# EAGLE design uStatusBoard (EAGLE 8.6.0)
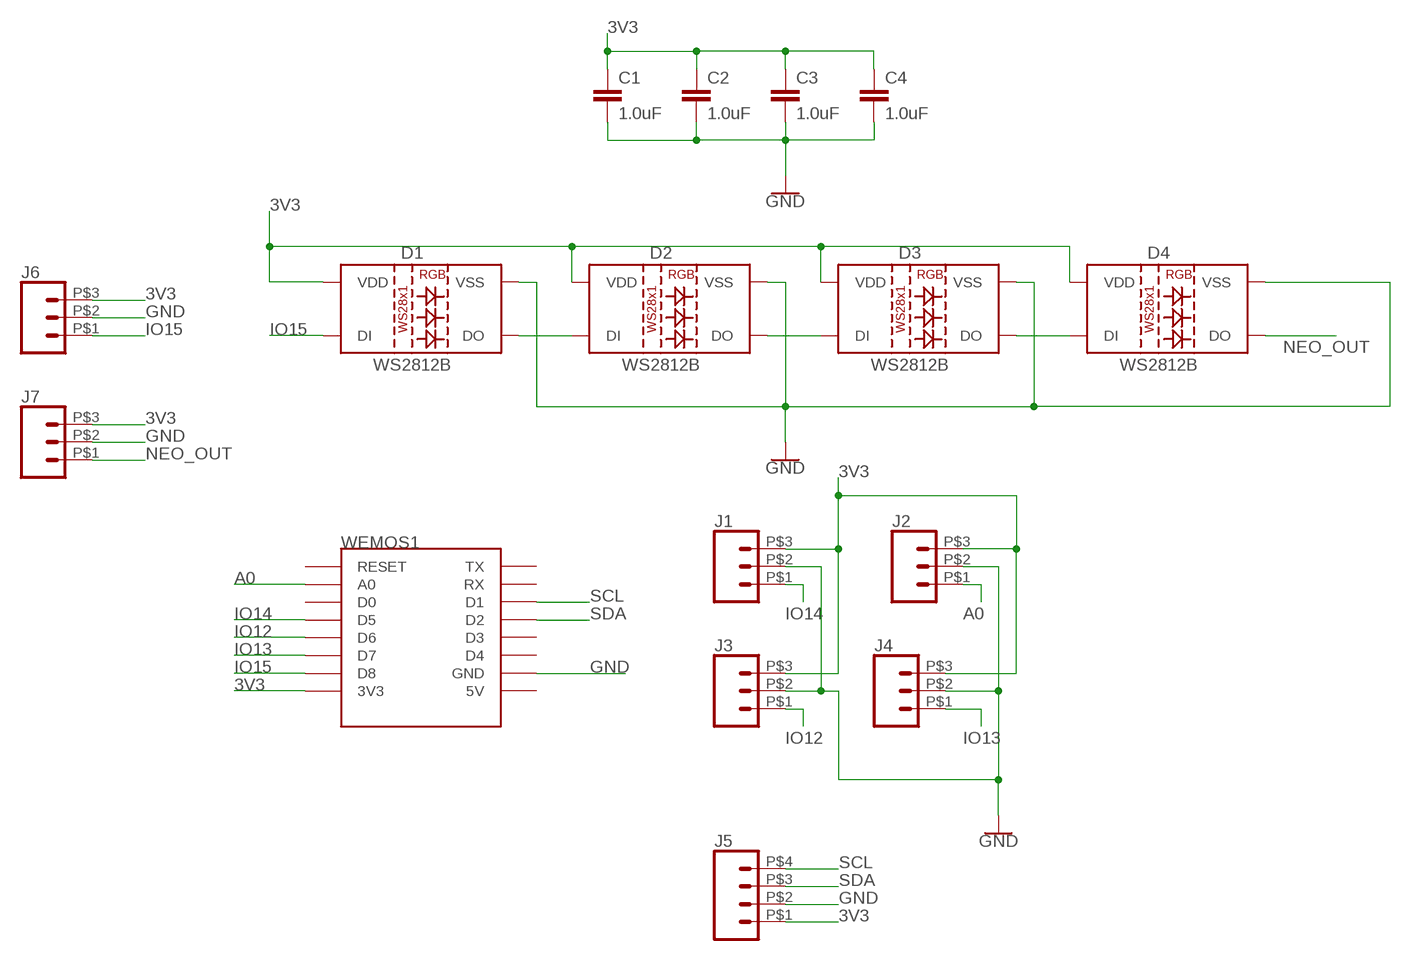
[diagram p0: schematic, sheet 1]

## Parts
C1  1.0uF  1.0UF-0805-25V-10%  [0805]
C2  1.0uF  1.0UF-0805-25V-10%  [0805]
C3  1.0uF  1.0UF-0805-25V-10%  [0805]
C4  1.0uF  1.0UF-0805-25V-10%  [0805]
D1  WS2812B  [WS2812B]
D2  WS2812B  [WS2812B]
D3  WS2812B  [WS2812B]
D4  WS2812B  [WS2812B]
J1  CONN_031X03_SMD  [1X03_SMD]
J2  CONN_031X03_SMD  [1X03_SMD]
J3  CONN_031X03_SMD  [1X03_SMD]
J4  CONN_031X03_SMD  [1X03_SMD]
J5  CONN_041X04_SMD  [1X04_SMD]
J6  CONN_031X03_SMD  [1X03_SMD]
J7  CONN_031X03_SMD  [1X03_SMD]
WEMOS1  WEMOS-D1-MINIWEMOS_SMD  [WEMOS-SMD]

## Nets
3V3: C1.1 C2.1 C3.1 C4.1 D1.1(VDD) D2.1(VDD) D3.1(VDD) D4.1(VDD) J1.P$3 J2.P$3 J3.P$3 J4.P$3 J5.P$1 J6.P$3 J7.P$3 WEMOS1.3V3
A0: J2.P$1 WEMOS1.A0
GND: C1.2 C2.2 C3.2 C4.2 D1.3(VSS) D2.3(VSS) D3.3(VSS) D4.3(VSS) J1.P$2 J2.P$2 J3.P$2 J4.P$2 J5.P$2 J6.P$2 J7.P$2 WEMOS1.GND
IO12: J3.P$1 WEMOS1.D6
IO13: J4.P$1 WEMOS1.D7
IO14: J1.P$1 WEMOS1.D5
IO15: D1.4(DI) J6.P$1 WEMOS1.D8
N$3: D1.2(DO) D2.4(DI)
N$4: D2.2(DO) D3.4(DI)
N$5: D3.2(DO) D4.4(DI)
NEO_OUT: D4.2(DO) J7.P$1
SCL: J5.P$4 WEMOS1.D1
SDA: J5.P$3 WEMOS1.D2
Unconnected: WEMOS1.5V WEMOS1.D0 WEMOS1.D3 WEMOS1.D4 WEMOS1.RESET WEMOS1.RX WEMOS1.TX

## Library data of the parts
C1-C4 = SparkFun-Capacitors:1.0UF: 1µF ceramic capacitors A capacitor is a passive two-terminal electrical component used to store electrical energy temporarily in an electric field.; PROD_ID: CAP-08064
D1-D4 = SparkFun-LED:WS2812B: WS2812B SMD addressable RGB LED 5x5mm SMD LED with built-in controller IC. Color: Red/Green/Blue mC Rating: RGB: 390, 660, 180 mcd Forward Voltage: RGB: 2.0, 3.0, 3.0 V Packages:WS2812B SparkFun Products: Blynk Board - ESP8266 <https://www.sparkfun.com/products/13794>; PROD_ID: DIO-12503
J1-J4 J6 J7 = SparkFun-Connectors:CONN_03: Multi connection point. Often used as Generic Header-pin footprint for 0.1 inch spaced/style header connections On any of the 0.1 inch spaced packages, you can populate with these: Break Away Headers - Straight <https://www.sparkfun.com/products/116> (PRT-00116) Break Away Male Headers - Right Angle <https://www.sparkfun.com/products/553> (PRT-00553) Female Headers <https://www.sparkfun.com/products/115> (PRT-00115) Break Away Headers - Machine Pin <https://www.sparkfun.com/products/117> (PRT-00117) Break Away Female Headers - Swiss Machine Pin <https://www.sparkfun.com/products/743> (PRT-00743) Stackable Header - 3 Pin (Female, 0.1") <https://www.sparkfun.com/products/13875> (PRT-13875) For SCREWTERMINALS and SPRING TERMINALS visit here: Screw Terimnals on SparkFun.com <https://www.sparkfun.com/search/results?term=Screw+Terminals> (5mm/3.5mm/2.54mm spacing) This device is also useful as a general connection point to wire up your design to another part of your project. Our various solder wires solder well into these plated through hole pads. Hook-Up Wire - Assortment (Stranded, 22 AWG) <https://www.sparkfun.com/products/11375> (PRT-11375) Hook-Up Wire - Assortment (Solid Core, 22 AWG) <https://www.sparkfun.com/products/11367> (PRT-11367) View the entire wire category on our website here <https://www.sparkfun.com/categories/141> Special notes: Molex polarized connector foot print use with SKU : PRT-08232 with associated crimp pins and housings.
J5 = SparkFun-Connectors:CONN_04: Multi connection point. Often used as Generic Header-pin footprint for 0.1 inch spaced/style header connections On any of the 0.1 inch spaced packages, you can populate with these: Break Away Headers - Straight <https://www.sparkfun.com/products/116> (PRT-00116) Break Away Male Headers - Right Angle <https://www.sparkfun.com/products/553> (PRT-00553) Female Headers <https://www.sparkfun.com/products/115> (PRT-00115) Break Away Headers - Machine Pin <https://www.sparkfun.com/products/117> (PRT-00117) Break Away Female Headers - Swiss Machine Pin <https://www.sparkfun.com/products/743> (PRT-00743) For SCREWTERMINALS and SPRING TERMINALS visit here: Screw Terimnals on SparkFun.com <https://www.sparkfun.com/search/results?term=Screw+Terminals> (5mm/3.5mm/2.54mm spacing) This device is also useful as a general connection point to wire up your design to another part of your project. Our various solder wires solder well into these plated through hole pads. Hook-Up Wire - Assortment (Stranded, 22 AWG) <https://www.sparkfun.com/products/11375> (PRT-11375) Hook-Up Wire - Assortment (Solid Core, 22 AWG) <https://www.sparkfun.com/products/11367> (PRT-11367) View the entire wire category on our website here <https://www.sparkfun.com/categories/141> Special notes: Molex polarized connector foot print use with SKU : PRT-08231 with associated crimp pins and housings. 1MM SMD Version SKU: PRT-10208
WEMOS1 = esp8266modules:WEMOS-D1-MINI: WeMos.cc D1 mini ESP8266 module

## Board
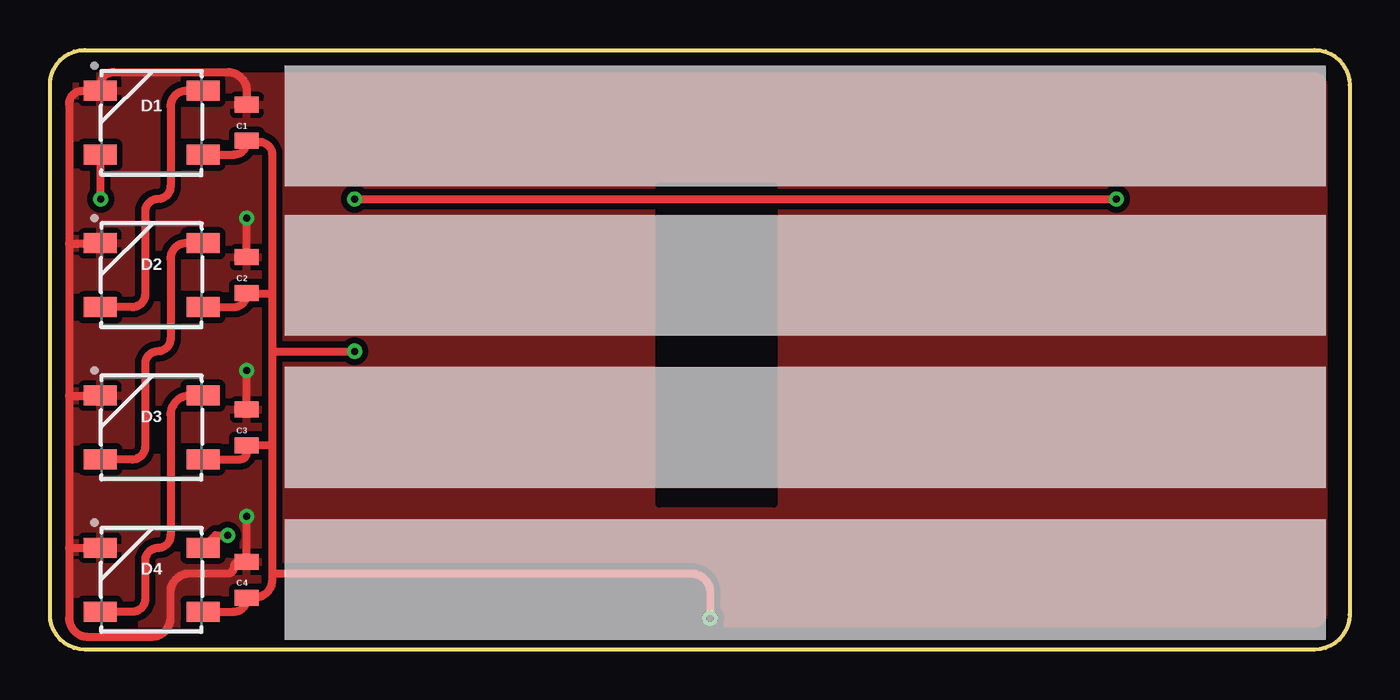
[diagram p1: board, top side]
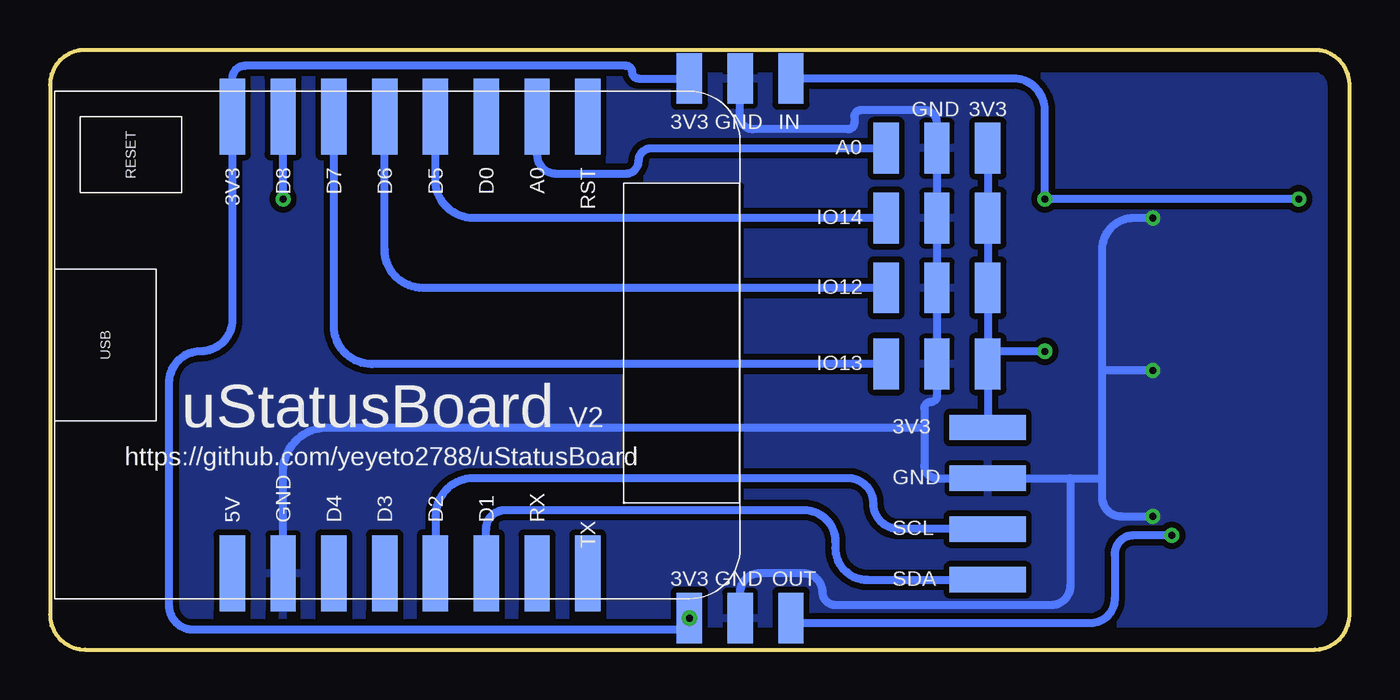
[diagram p2: board, bottom side, seen from below]

Size 65 x 30 mm. Coordinates in mm from the lower left corner, seen from the top.
Outline: 1.75,30 63.25,30 63.52,29.98 63.79,29.91 64.05,29.81 64.28,29.67 64.49,29.49 64.67,29.28 64.81,29.05 64.92,28.79 64.98,28.52 65,28.25 65,1.75 64.98,1.48 64.92,1.21 64.81,0.95 64.67,0.72 64.49,0.51 64.28,0.33 64.05,0.19 63.79,0.09 63.52,0.02 63.25,0 1.75,0 1.48,0.02 1.21,0.09 0.95,0.19 0.72,0.33 0.51,0.51 0.33,0.72 0.19,0.95 0.09,1.21 0.02,1.48 0,1.75 0,28.25 0.02,28.52 0.09,28.79 0.19,29.05 0.33,29.28 0.51,29.49 0.72,29.67 0.95,29.81 1.21,29.91 1.48,29.98 1.75,30
Copper layers (1*16): Top 0.035mm / dielectric 1.5mm / Bottom 0.035mm
Design rules "default": minimum track width 6mil, minimum drill 0.35mm, track to track 6mil, track to pad 6mil, pad to pad 6mil, via to via 6mil, smd to smd 6mil, copper to edge 40mil, drill to drill 6mil, minimum pad ring 10mil, minimum via ring 8mil, stop-mask expansion 4mil, vias tented up to drill 0mil, thermal gap 10mil

### Footprints (pad centres in the part's own frame; a part is rotated, then mirrored left to right if it is on the bottom)
0805 = smd 0.8 x 1.2: 1 -0.9,0; 2 0.9,0
WS2812B = smd 1.651 x 1: 1 2.577,-1.6; 2 2.577,1.6; 3 -2.577,1.6; 4 -2.577,-1.6
1X03_SMD = smd 2.54 x 1.27: P$1 0,-2.54; P$2 0,0; P$3 0,2.54
1X04_SMD = smd 3.81 x 1.27: P$1 0,3.81; P$2 0,1.27; P$3 0,-1.27; P$4 0,-3.81
WEMOS-SMD = smd 3.81 x 1.27: 3V3 -11.43,-10.16; 5V 11.43,-10.16; A0 -11.43,5.08; D0 -11.43,2.54; D1 11.43,2.54; D2 11.43,0; D3 11.43,-2.54; D4 11.43,-5.08; D5 -11.43,0; D6 -11.43,-2.54; D7 -11.43,-5.08; D8 -11.43,-7.62; GND 11.43,-7.62; RESET -11.43,7.62; RX 11.43,5.08; TX 11.43,7.62

### Placement (x,y rotation side)
C1  9.84,26.35 90 top
C2  9.84,18.73 90 top
C3  9.84,11.11 90 top
C4  9.84,3.49 90 top
D1  5.08,26.35 0 top
D2  5.08,18.73 0 top
D3  5.08,11.11 0 top
D4  5.08,3.49 0 top
J1  20.64,21.59 270 bottom
J2  20.64,25.08 270 bottom
J3  20.64,18.1 270 bottom
J4  20.64,14.29 270 bottom
J5  18.1,7.3 0 bottom
J6  30.48,28.57 90 bottom
J7  30.48,1.57 90 bottom
WEMOS1  45.72,15.24 270 bottom

### Tracks (layer width: path | path; a pad name or v marks a point on that pad's centre or on a via)
3V3  (via drill 0.35)
  Top 0.406: D4.1 9.21,1.89 arc90 9.84,2.53 C4.1 10.21,2.59 arc90 11.11,3.49 11.11,3.81 | D3.1 7.66,9.53 9.53,9.53 arc90 9.84,9.84 C3.1 11.11,10.21 | D2.1 9.2,17.13 arc90 9.84,17.78 | 9.84,17.78 C2.1 | D1.1 7.66,24.77 9.21,24.77 arc90 9.84,25.4 | C1.1 9.84,25.4 | 9.84,25.4 10.48,25.4 arc-90 11.11,24.77 11.11,17.78 | 11.11,17.78 9.84,17.78 | 11.11,17.78 11.11,14.92 | 11.11,14.92 11.11,10.21 | 11.11,10.21 11.11,3.81 | 11.11,14.92 v15.24,14.92 | 11.11,3.81 32.07,3.81 arc-90 33.02,2.86 J7.P$3
  Bottom 0.406: J2.P$3 J1.P$3 J3.P$3 18.1,14.92 | 18.1,14.92 J4.P$3 J5.P$1 | v15.24,14.92 18.1,14.92 | J7.P$3 33.02,0.95 33.07,1 57.83,1 arc90 59.05,2.22 59.05,13.34 arc90 57.47,14.92 arc-90 55.88,16.51 WEMOS1.3V3 55.88,28.57 arc90 55.24,29.21 36.2,29.21 arc90 35.88,28.89 arc-90 35.56,28.57 J6.P$3
  other vias: 33.02,1.57
A0
  Bottom 0.406: WEMOS1.A0 40.64,24.77 arc-90 39.69,23.81 36.2,23.81 arc-90 35.56,24.45 arc90 34.92,25.08 J2.P$1
GND  (via drill 0.35)
  Top 0.406: C1.2 9.84,27.94 arc90 8.89,28.89 3.17,28.89 arc90 2.54,28.26 2.54,27.95 D1.3 1.59,27.94 arc90 0.95,27.3 0.95,20.32 | D2.3 0.95,20.32 | 0.95,20.32 0.95,12.7 | 0.95,12.7 D3.3 | 0.95,12.7 0.95,5.09 | 0.95,5.09 D4.3 | 0.95,5.09 0.95,1.59 arc90 1.91,0.64 5.08,0.64 arc90 6.03,1.59 6.03,2.86 arc-90 6.99,3.81 8.89,3.81 arc90 9.21,4.13 arc-90 9.47,4.39 C4.2 v9.84,6.67 | C3.2 v9.84,13.97 | C2.2 v9.84,21.59
  Bottom 0.406: 12.38,8.57 12.38,7.62 arc-90 11.43,6.67 v9.84,6.67 | v9.84,13.97 12.38,13.97 | 12.38,13.97 12.38,8.57 | v9.84,21.59 10.79,21.59 arc-90 12.38,20 12.38,13.97 | 21.27,11.11 21.27,12.06 arc90 20.95,12.38 arc-90 20.64,12.7 J4.P$2 J3.P$2 J1.P$2 J2.P$2 20.64,26.35 arc-90 21.27,26.99 24.45,26.99 arc-90 24.77,26.67 24.77,26.35 arc90 25.08,26.04 29.84,26.04 arc90 30.48,26.67 J6.P$2 | 21.27,11.11 21.27,9.21 arc-90 20.64,8.57 J5.P$2 13.97,8.57 | 13.97,8.57 12.38,8.57 | WEMOS1.GND 53.34,8.89 arc90 51.12,11.11 21.27,11.11 | 13.97,8.57 13.97,3.17 arc90 14.92,2.22 25.72,2.22 arc90 26.35,2.86 arc-90 27.3,3.81 29.53,3.81 arc-90 30.48,2.86 J7.P$2
  pour Bottom (isolate 0.305): -0.32,30.16 65.41,30.16 65.41,0 -0.32,0
  pour Top (isolate 0.305): -0.32,30.48 65.41,30.16 65.41,0 -0.32,0
IO12
  Bottom 0.406: J3.P$1 46.35,18.1 arc90 48.26,20 WEMOS1.D6
IO13
  Bottom 0.406: J4.P$1 48.9,14.29 arc90 50.8,16.19 WEMOS1.D7
IO14
  Bottom 0.406: J1.P$1 43.81,21.59 arc90 45.72,23.5 WEMOS1.D5
IO15  (via drill 0.35)
  Top 0.406: D1.4 2.5,22.54 v2.54,22.54 | v15.24,22.54 v53.34,22.54
  Bottom 0.406: v2.54,22.54 v15.24,22.54 15.24,26.99 arc-90 16.83,28.57 J6.P$1 | v53.34,22.54 WEMOS1.D8
N$2
  cutout Top: 30.48,23.18 36.2,23.18 36.2,7.3 30.48,7.3
N$3
  Top 0.406: D1.2 6.81,27.95 arc90 6.03,27.18 6.03,23.18 arc-90 5.4,22.54 arc90 4.76,21.91 4.76,17.78 arc-90 4.12,17.13 D2.4
N$4
  Top 0.406: D2.2 6.81,20.33 arc90 6.03,19.56 6.03,15.56 arc-90 5.4,14.92 arc90 4.76,14.29 4.76,10.16 arc-90 4.12,9.51 D3.4
N$5
  Top 0.406: D3.2 6.99,12.7 arc90 6.03,11.75 6.03,5.71 arc-90 5.4,5.08 arc90 4.76,4.45 4.76,2.54 arc-90 4.12,1.89 D4.4
N$6
  cutout Bottom: 30.48,23.18 36.2,23.18 36.2,7.3 30.48,7.3
NEO_OUT  (via drill 0.35)
  Top 0.406: D4.2 8.28,5.71 v8.89,5.71
  Bottom 0.406: v8.89,5.71 10.79,5.71 arc-90 11.75,4.76 11.75,2.54 arc90 12.97,1.32 27.68,1.32 J7.P$1
SCL
  Bottom 0.406: WEMOS1.D1 43.18,6.03 arc90 42.23,6.99 27.3,6.99 arc90 25.72,5.4 25.72,5.08 arc-90 24.13,3.49 J5.P$4
SDA
  Bottom 0.406: J5.P$3 22.54,6.03 arc90 23.81,7.3 arc-90 25.08,8.57 43.81,8.57 arc-90 45.72,6.67 WEMOS1.D2

### Text on the board
bNames: 3V3 | GND | IN | GND | 3V3 | A0 | IO14 | IO12 | IO13 | 3V3 | V2 | uStatusBoard | https://github.com/yeyeto2788/uStatusBoard | GND | SCL | SDA | OUT | GND | 3V3